# EAGLE design board design (EAGLE 7.6.0)
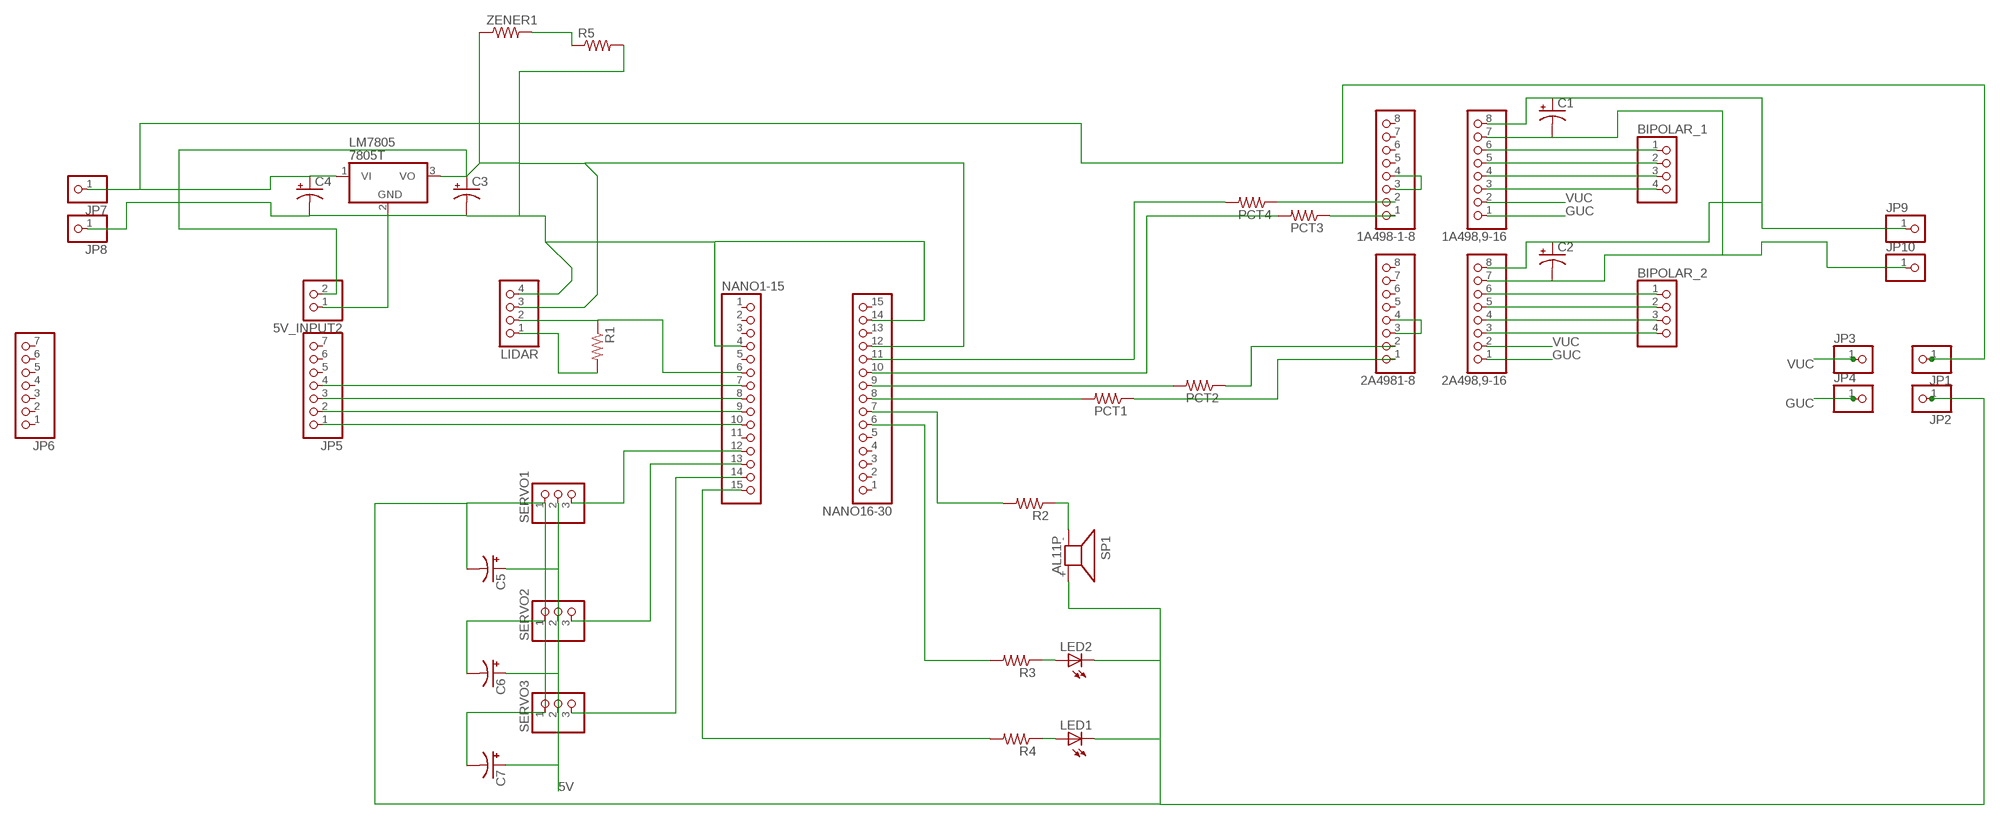
[diagram p0: schematic, sheet 1]

## Parts
1A498,9-16  PINHD-1X8  [1X08]
1A498-1-8  PINHD-1X8  [1X08]
2A498,9-16  PINHD-1X8  [1X08]
2A4981-8  PINHD-1X8  [1X08]
5V_INPUT2  PINHD-1X2  [1X02]
BIPOLAR_1  PINHD-1X4  [1X04]
BIPOLAR_2  PINHD-1X4  [1X04]
C1  CPOL-USE2.5-7  [E2,5-7]
C2  CPOL-USE2.5-7  [E2,5-7]
C3  CPOL-USE2.5-7  [E2,5-7]
C4  CPOL-USE2.5-7  [E2,5-7]
C5  CPOL-USE2.5-7  [E2,5-7]
C6  CPOL-USE2.5-7  [E2,5-7]
C7  CPOL-USE2.5-7  [E2,5-7]
JP1  PINHD-1X1  [1X01]
JP2  PINHD-1X1  [1X01]
JP3  PINHD-1X1  [1X01]
JP4  PINHD-1X1  [1X01]
JP5  PINHD-1X7  [1X07]
JP6  PINHD-1X7  [1X07]
JP7  PINHD-1X1  [1X01]
JP8  PINHD-1X1  [1X01]
JP9  PINHD-1X1  [1X01]
JP10  PINHD-1X1  [1X01]
LED1  LED5MM  [LED5MM]
LED2  LED5MM  [LED5MM]
LIDAR  PINHD-1X4  [1X04]
LM7805  7805T  [TO220H]
NANO1-15  PINHD-1X15  [1X15]
NANO16-30  PINHD-1X15  [1X15]
PCT1  R-US_0207/10  [0207/10]
PCT2  R-US_0207/10  [0207/10]
PCT3  R-US_0207/10  [0207/10]
PCT4  R-US_0207/10  [0207/10]
R1  R-US_0207/10  [0207/10]
R2  R-US_0207/10  [0207/10]
R3  R-US_0207/10  [0207/10]
R4  R-US_0207/10  [0207/10]
R5  R-US_0207/10  [0207/10]
SERVO1  PINHD-1X3  [1X03]
SERVO2  PINHD-1X3  [1X03]
SERVO3  PINHD-1X3  [1X03]
SP1  AL11P  [AL11P]
ZENER1  R-US_0207/10  [0207/10]

## Nets
5V: C4.+ C5.+ C6.+ C7.+ JP1.1 JP7.1 LM7805.1(VI) SERVO1.2 SERVO2.2 SERVO3.2
GUC: 1A498,9-16.1 2A498,9-16.1 JP4.1
N$1: JP5.4 NANO1-15.7
N$2: JP5.3 NANO1-15.8
N$3: JP5.2 NANO1-15.9
N$4: JP5.1 NANO1-15.10
N$5: NANO16-30.7 R2.2
N$6: LED2.A R3.1
N$7: 1A498-1-8.2 PCT4.1
N$8: NANO16-30.8 PCT1.2
N$9: 2A498,9-16.6 BIPOLAR_2.1
N$10: 2A498,9-16.5 BIPOLAR_2.2
N$11: 2A498,9-16.4 BIPOLAR_2.3
N$12: 2A498,9-16.3 BIPOLAR_2.4
N$13: 1A498,9-16.6 BIPOLAR_1.1
N$14: 1A498,9-16.5 BIPOLAR_1.2
N$15: 1A498,9-16.4 BIPOLAR_1.3
N$16: 1A498,9-16.3 BIPOLAR_1.4
N$17: LED1.A R4.1
N$18: NANO1-15.15 R4.2
N$19: R2.1 SP1.-
N$20: LIDAR.2 NANO1-15.6 R1.1
N$21: LIDAR.1 R1.2
N$22: 1A498,9-16.7 2A498,9-16.7 C1.- C2.- JP10.1
N$23: 2A4981-8.3 2A4981-8.4
N$24: 1A498-1-8.3 1A498-1-8.4
N$25: 1A498,9-16.8 2A498,9-16.8 C1.+ C2.+ JP9.1
N$26: NANO1-15.12 SERVO1.3
N$27: NANO1-15.13 SERVO2.3
N$28: NANO1-15.14 SERVO3.3
N$29: NANO16-30.11 PCT4.2
N$30: NANO16-30.10 PCT3.2
N$31: NANO16-30.9 PCT2.2
N$32: 2A4981-8.1 PCT1.1
N$33: NANO16-30.6 R3.2
N$34: 2A4981-8.2 PCT2.1
N$35: 1A498-1-8.1 PCT3.1
N$36: C5.- C6.- C7.- JP2.1 LED1.K(C) LED2.K(C) SERVO1.1 SERVO2.1 SERVO3.1 SP1.+
N$37: 5V_INPUT2.2 C3.+ LIDAR.3 LM7805.3(VO) NANO16-30.12 ZENER1.1
N$38: 5V_INPUT2.1 C3.- C4.- JP8.1 LIDAR.4 LM7805.2(GND) NANO1-15.4 NANO16-30.14 R5.2
N$40: R5.1 ZENER1.2
VUC: 1A498,9-16.2 2A498,9-16.2 JP3.1
Unconnected: 1A498-1-8.5 1A498-1-8.6 1A498-1-8.7 1A498-1-8.8 2A4981-8.5 2A4981-8.6 2A4981-8.7 2A4981-8.8 JP5.5 JP5.6 JP5.7 JP6.1 JP6.2 JP6.3 JP6.4 JP6.5 JP6.6 JP6.7 NANO1-15.1 NANO1-15.2 NANO1-15.3 NANO1-15.5 NANO1-15.11 NANO16-30.1 NANO16-30.2 NANO16-30.3 NANO16-30.4 NANO16-30.5 NANO16-30.13 NANO16-30.15

## Library data of the parts
1A498,9-16 1A498-1-8 2A498,9-16 2A4981-8 = pinhead:PINHD-1X8: PIN HEADER
5V_INPUT2 = pinhead:PINHD-1X2: PIN HEADER
BIPOLAR_1 BIPOLAR_2 LIDAR = pinhead:PINHD-1X4: PIN HEADER
C1-C7 = rcl:CPOL-US: POLARIZED CAPACITOR, American symbol
JP1-JP4 JP7-JP10 = pinhead:PINHD-1X1: PIN HEADER
JP5 JP6 = pinhead:PINHD-1X7: PIN HEADER
LED1 LED2 = led:LED: LED OSRAM: - CHIPLED LG R971, LG N971, LY N971, LG Q971, LY Q971, LO R971, LY R971 LH N974, LH R974 LS Q976, LO Q976, LY Q976 LO Q996 - Hyper CHIPLED LW Q18S LB Q993, LB Q99A, LB R99A - SideLED LS A670, LO A670, LY A670, LG A670, LP A670 LB A673, LV A673, LT A673, LW A673 LH A674 LY A675 LS A676, LA A676, LO A676, LY A676, LW A676 LS A679, LY A679, LG A679 - Hyper Micro SIDELED® LS Y876, LA Y876, LO Y876, LY Y876 LT Y87S - SmartLED LW L88C, LW L88S LB L89C, LB L89S, LG L890 LS L89K, LO L89K, LY L89K LS L896, LA L896, LO L896, LY L896 - TOPLED LS T670, LO T670, LY T670, LG T670, LP T670 LSG T670, LSP T670, LSY T670, LOP T670, LYG T670 LG T671, LOG T671, LSG T671 LB T673, LV T673, LT T673, LW T673 LH T674 LS T676, LA T676, LO T676, LY T676, LB T676, LH T676, LSB T676, LW T676 LB T67C, LV T67C, LT T67C, LS T67K, LO T67K, LY T67K, LW E67C LS E67B, LA E67B, LO E67B, LY E67B, LB E67C, LV E67C, LT E67C LW T67C LS T679, LY T679, LG T679 LS T770, LO T770, LY T770, LG T770, LP T770 LB T773, LV T773, LT T773, LW T773 LH T774 LS E675, LA E675, LY E675, LS T675 LS T776, LA T776, LO T776, LY T776, LB T776 LHGB T686 LT T68C, LB T68C - Hyper Mini TOPLED® LB M676 - Mini TOPLED Santana® LG M470 LS M47K, LO M47K, LY M47K Source: http://www.osram.convergy.de LUXEON: - LUMILED® LXK2-PW12-R00, LXK2-PW12-S00, LXK2-PW14-U00, LXK2-PW14-V00 LXK2-PM12-R00, LXK2-PM12-S00, LXK2-PM14-U00 LXK2-PE12-Q00, LXK2-PE12-R00, LXK2-PE12-S00, LXK2-PE14-T00, LXK2-PE14-U00 LXK2-PB12-K00, LXK2-PB12-L00, LXK2-PB12-M00, LXK2-PB14-N00, LXK2-PB14-P00, LXK2-PB14-Q00 LXK2-PR12-L00, LXK2-PR12-M00, LXK2-PR14-Q00, LXK2-PR14-R00 LXK2-PD12-Q00, LXK2-PD12-R00, LXK2-PD12-S00 LXK2-PH12-R00, LXK2-PH12-S00 LXK2-PL12-P00, LXK2-PL12-Q00, LXK2-PL12-R00 Source: www.luxeon.com KINGBRIGHT: KA-3528ASYC Source: www.kingbright.com
LM7805 = linear:78*: Positive VOLTAGE REGULATOR Source: http://cache.national.com/ds/LM/LM78L05.pdf http://www.fairchildsemi.com/ds/LM/LM7805.pdf
NANO1-15 NANO16-30 = pinhead:PINHD-1X15: PIN HEADER
PCT1-PCT4 R1-R5 ZENER1 = resistor:R-US_: RESISTOR, American symbol
SERVO1-SERVO3 = pinhead:PINHD-1X3: PIN HEADER
SP1 = buzzer:AL11P: SPEAKER Source: Buerklin; OC_FARNELL: unknown; OC_NEWARK: unknown

## Net classes
0 default: width 0.813 mm, drill 0.813 mm, clearance 0.813 mm

## Board
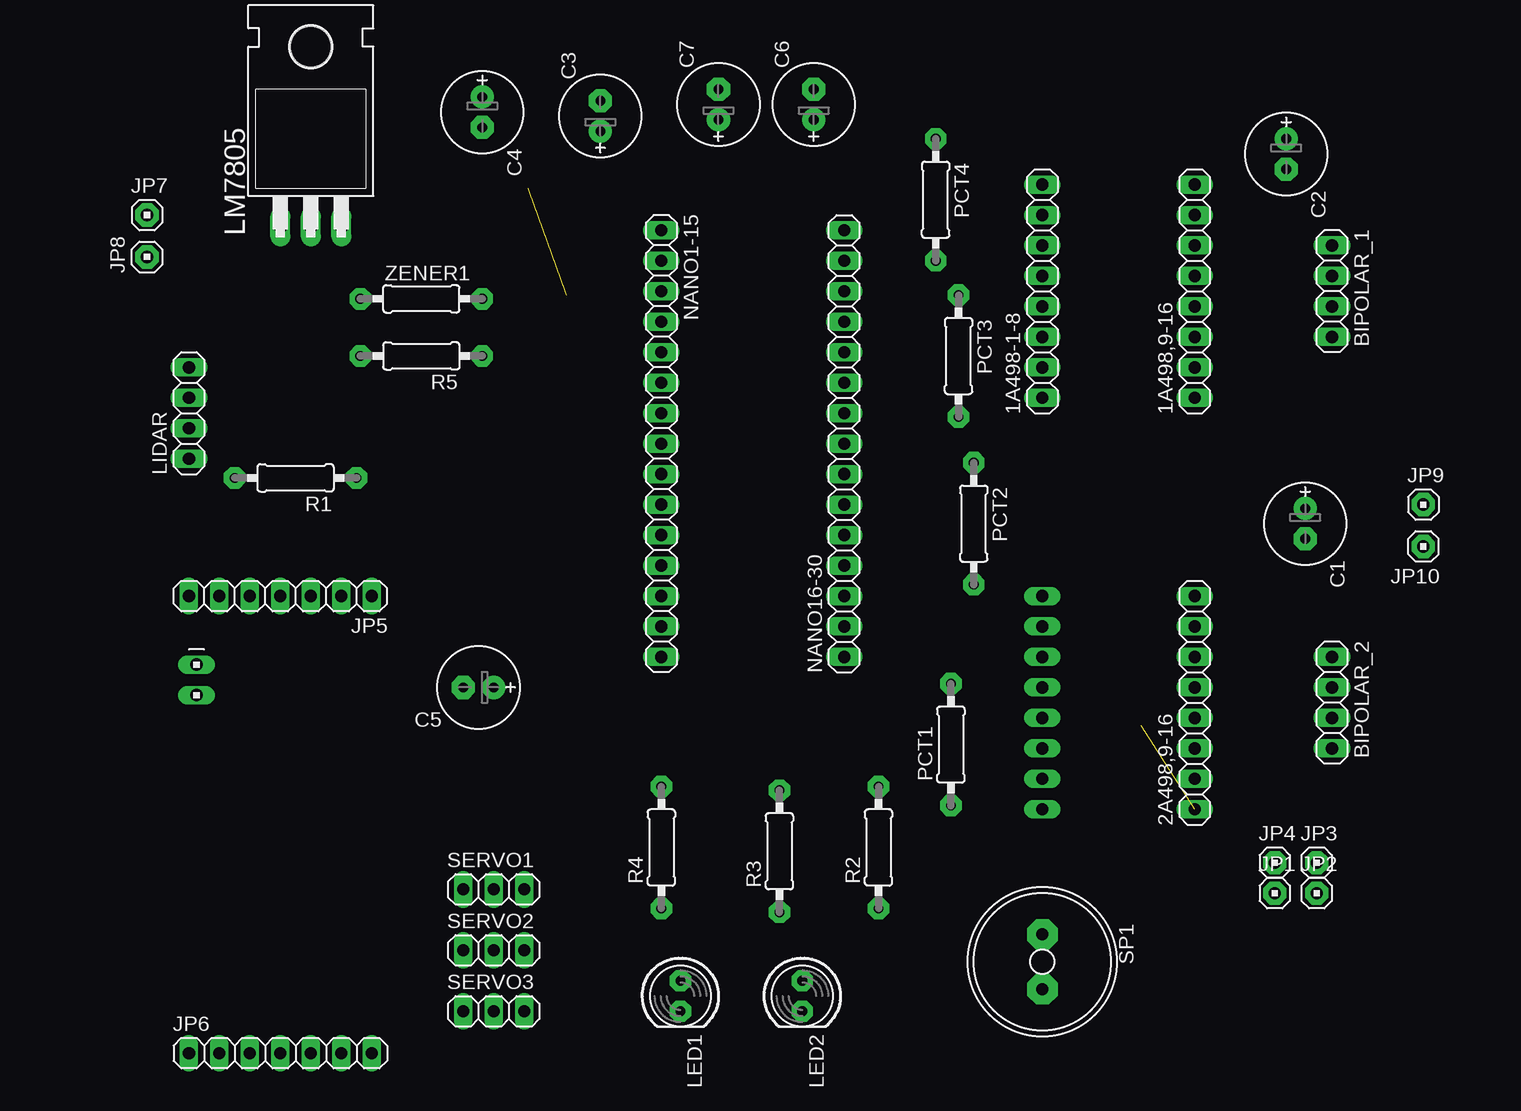
[diagram p1: board, top side]
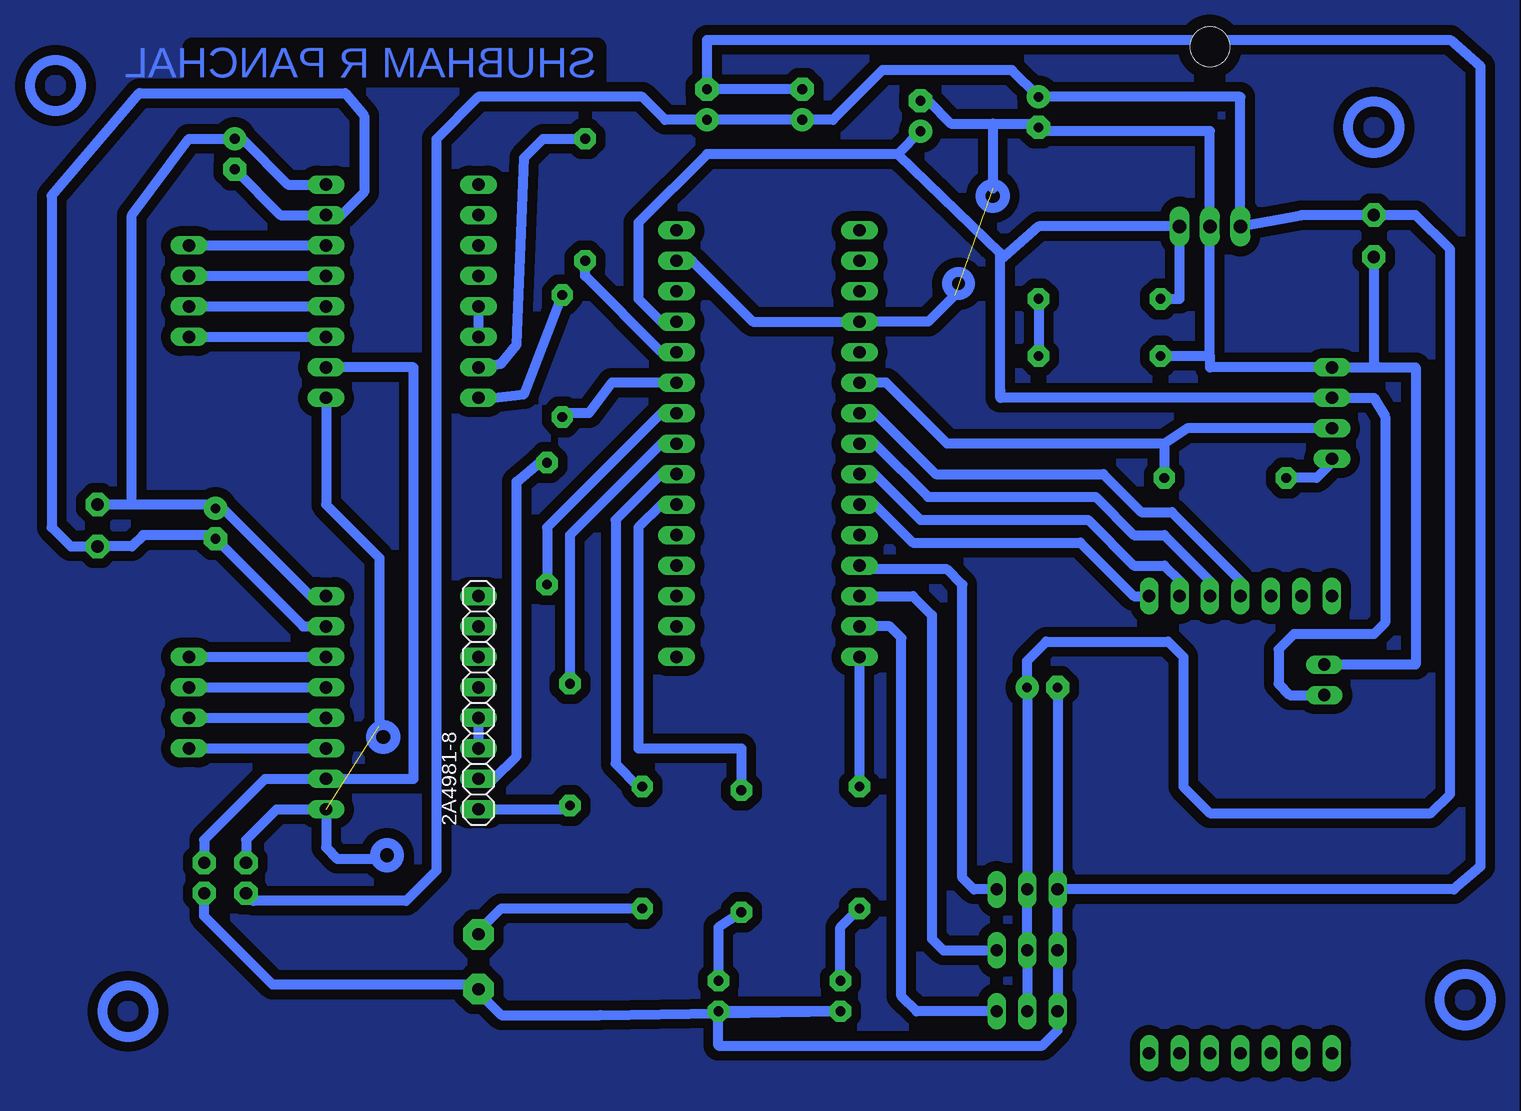
[diagram p2: board, bottom side, seen from below]

No outline drawn. Coordinates in mm, seen from the top.
Copper layers (1*16): Top 0.035mm / dielectric 1.5mm / Bottom 0.035mm
Design rules "default": minimum track width 10mil, minimum drill 24mil, track to track 8mil, track to pad 8mil, pad to pad 8mil, via to via 8mil, smd to smd 8mil, copper to edge 40mil, drill to drill 8mil, minimum pad ring 10mil, minimum via ring 8mil, stop-mask expansion 4mil, vias tented up to drill 0mil, thermal gap 10mil

### Footprints (pad centres in the part's own frame; a part is rotated, then mirrored left to right if it is on the bottom)
1X08 = drill 1.016 long: 1 -8.89,0; 2 -6.35,0; 3 -3.81,0; 4 -1.27,0; 5 1.27,0; 6 3.81,0; 7 6.35,0; 8 8.89,0
1X02 = drill 1.016 long: 1 -1.27,0; 2 1.27,0
1X04 = drill 1.016 long: 1 -3.81,0; 2 -1.27,0; 3 1.27,0; 4 3.81,0
E2,5-7 = drill 0.813 pad 1.93: + -1.27,0 | drill 0.813 pad 1.93 octagon: - 1.27,0
1X01 = drill 1.016 pad 1.93 octagon: 1 0,0
1X07 = drill 1.016 long: 1 -7.62,0; 2 -5.08,0; 3 -2.54,0; 4 0,0; 5 2.54,0; 6 5.08,0; 7 7.62,0
LED5MM = drill 0.813 pad 1.778 octagon: A -1.27,0; K 1.27,0
TO220H = drill 1.118 long: 1 -2.54,-10.16; 2 0,-10.16; 3 2.54,-10.16 | hole 3.302: 0,4.826
1X15 = drill 1.016 long: 1 -17.78,0; 2 -15.24,0; 3 -12.7,0; 4 -10.16,0; 5 -7.62,0; 6 -5.08,0; 7 -2.54,0; 8 0,0; 9 2.54,0; 10 5.08,0; 11 7.62,0; 12 10.16,0; 13 12.7,0; 14 15.24,0; 15 17.78,0
0207/10 = drill 0.813 pad 1.778 octagon: 1 -5.08,0; 2 5.08,0
1X03 = drill 1.016 long: 1 -2.54,0; 2 0,0; 3 2.54,0
AL11P = drill 1.016 pad 2.54 octagon: + 2.286,0; - -2.286,0

### Placement (x,y rotation side)
1A498,9-16  90.81,62.87 90 top
1A498-1-8  78.11,62.87 90 top
2A498,9-16  90.81,28.57 90 top
2A4981-8  78.11,28.57 90 bottom
5V_INPUT2  7.62,30.48 270 top
BIPOLAR_1  102.23,62.87 270 top
BIPOLAR_2  102.23,28.57 270 top
C1  100.01,43.5 270 top
C2  98.42,74.3 270 top
C3  41.27,77.47 90 top
C4  31.43,77.79 270 top
C5  31.11,29.84 180 top
C6  59.05,78.42 90 top
C7  51.12,78.42 90 top
JP1  97.47,12.7 0 top
JP2  100.97,12.7 0 top
JP3  100.97,15.24 0 top
JP4  97.47,15.24 0 top
JP5  14.61,37.47 180 top
JP6  14.61,-0.64 0 top
JP7  3.49,69.22 0 top
JP8  3.49,65.72 90 top
JP9  109.86,45.09 0 top
JP10  109.86,41.59 180 top
LED1  47.94,4.13 270 top
LED2  58.1,4.13 270 top
LIDAR  6.99,52.7 90 top
LM7805  17.14,78.42 0 top
NANO1-15  46.35,50.16 270 top
NANO16-30  61.59,50.16 90 top
PCT1  70.48,25.08 90 top
PCT2  72.39,43.5 270 top
PCT3  71.12,57.47 270 top
PCT4  69.22,70.48 270 top
R1  15.88,47.31 180 top
R2  64.45,16.51 90 top
R3  56.2,16.19 90 top
R4  46.35,16.51 90 top
R5  26.35,57.47 180 top
SERVO1  32.38,13.02 0 top
SERVO2  32.38,7.94 0 top
SERVO3  32.38,2.86 0 top
SP1  78.11,6.99 270 top
ZENER1  26.35,62.23 0 top

### Tracks (layer width: path | path; a pad name or v marks a point on that pad's centre or on a via)
5V
  Bottom 0.813: SERVO3.2 SERVO2.2 SERVO1.2 C5.+ 32.38,32.07 30.8,33.66 20.64,33.66 19.37,32.38 19.37,21.59 17.14,19.37 -1.27,19.37 -2.86,20.95 -2.86,66.36 0,69.22 JP7.1 9.53,69.22 LM7805.1 14.61,79.06 C4.+ 33.66,81.28 44.45,81.28 48.58,77.15 C7.+ C6.+ 62.55,77.15 64.45,79.06 78.11,79.06 81.6,75.56 81.6,14.61 84.14,12.06 96.84,12.06 JP1.1
GUC  (1 unrouted)
  Bottom 0.813: 1A498,9-16.1 90.81,45.09 86.36,40.64 86.36,26.67 | 86.68,15.56 89.85,15.56 90.81,16.51 2A498,9-16.1 94.93,19.68 97.47,17.14 JP4.1
N$1
  Bottom 0.813: JP5.4 14.61,38.73 20.32,44.45 22.86,44.45 26.04,47.62 40.01,47.62 45.09,52.7 NANO1-15.7
N$2
  Bottom 0.813: JP5.3 17.14,38.73 20.95,42.55 23.5,42.55 26.67,45.72 40.64,45.72 45.09,50.16 NANO1-15.8
N$3
  Bottom 0.813: JP5.2 19.68,38.73 20.95,40.01 23.5,40.01 27.3,43.81 41.27,43.81 45.09,47.62 NANO1-15.9
N$4
  Bottom 0.813: JP5.1 23.5,37.47 27.94,41.91 41.91,41.91 45.09,45.09 NANO1-15.10
N$5
  Bottom 0.813: NANO16-30.7 62.87,47.62 66.67,43.81 66.67,23.5 64.77,21.59 R2.2
N$6
  Bottom 0.813: LED2.A 58.1,9.84 R3.1
N$7
  Bottom 0.813: PCT4.1 72.71,75.56 74.3,73.98 74.93,58.42 76.2,56.83 1A498-1-8.2
N$8
  Bottom 0.813: PCT1.2 70.48,42.55 62.87,50.16 NANO16-30.8
N$9
  Bottom 0.813: BIPOLAR_2.1 2A498,9-16.6
N$10
  Bottom 0.813: BIPOLAR_2.2 2A498,9-16.5
N$11
  Bottom 0.813: BIPOLAR_2.3 2A498,9-16.4
N$12
  Bottom 0.813: BIPOLAR_2.4 2A498,9-16.3
N$13
  Bottom 0.813: BIPOLAR_1.1 1A498,9-16.6
N$14
  Bottom 0.813: BIPOLAR_1.2 1A498,9-16.5
N$15
  Bottom 0.813: BIPOLAR_1.3 1A498,9-16.4
N$16
  Bottom 0.813: BIPOLAR_1.4 1A498,9-16.3
N$17
  Bottom 0.813: LED1.A 47.94,9.84 R4.1
N$18
  Bottom 0.813: NANO1-15.15 R4.2
N$19
  Bottom 0.813: R2.1 76.2,11.43 78.11,9.53 SP1.-
N$20
  Bottom 0.813: 20.95,50.16 19.05,51.44 LIDAR.2 | 20.95,50.16 R1.1 | 20.95,50.16 39.05,50.16 44.13,55.24 NANO1-15.6
N$21
  Bottom 0.813: LIDAR.1 6.99,48.58 8.26,47.31 R1.2
N$22
  Bottom 0.813: C2.- 94.61,69.22 1A498,9-16.7 89.53,69.22 87.63,71.12 87.63,77.47 89.22,79.38 106.36,79.38 113.67,70.8 113.67,43.18 112.08,41.59 JP10.1 107,41.59 106.05,42.55 100.33,42.55 C1.- 92.71,34.92 2A498,9-16.7
N$23
  Bottom 0.813: 2A4981-8.4 2A4981-8.3
N$24
  Bottom 0.813: 1A498-1-8.4 1A498-1-8.3
N$25
  Bottom 0.813: 1A498,9-16.8 93.98,71.75 97.79,75.56 C2.+ 102.23,75.56 107,69.22 107,45.09 | 2A498,9-16.8 92.08,37.47 99.69,45.09 C1.+ 100.33,45.09 107,45.09 | 107,45.09 JP9.1
N$26
  Bottom 0.813: SERVO1.3 36.83,13.02 37.78,13.97 37.78,38.42 39.05,39.69 46.04,39.69 NANO1-15.12
N$27
  Bottom 0.813: NANO1-15.13 41.91,37.47 40.32,35.88 40.32,8.89 39.37,7.94 SERVO2.3
N$28
  Bottom 0.813: SERVO3.3 41.59,2.86 42.86,4.13 42.86,33.97 43.81,34.92 NANO1-15.14
N$29
  Bottom 0.813: PCT4.2 69.22,64.14 62.87,57.78 NANO16-30.11
N$30
  Bottom 0.813: NANO16-30.10 66.99,55.24 68.9,52.7 71.12,52.7 PCT3.2
N$31
  Bottom 0.813: PCT2.2 72.39,43.18 62.87,52.7 NANO16-30.9
N$32
  Bottom 0.813: 2A4981-8.1 70.48,19.68 PCT1.1
N$33
  Bottom 0.813: R3.2 56.2,24.77 64.77,24.77 64.77,43.18 62.87,45.09 NANO16-30.6
N$34
  Bottom 0.813: 2A4981-8.2 76.83,22.23 74.93,24.13 74.93,46.99 73.03,48.58 PCT2.1
N$35
  Bottom 0.813: PCT3.1 74.3,54.29 76.83,53.98 1A498-1-8.1
N$36
  Bottom 0.813: SERVO1.1 SERVO2.1 SERVO3.1 29.84,1.27 31.11,0 58.1,0 LED2.K LED1.K 67.94,2.54 76.2,2.54 78.11,4.45 SP1.+ 78.11,5.08 95.25,5.08 100.97,10.79 JP2.1 | SERVO1.1 -3.17,13.02 -5.4,14.92 -5.4,81.6 -2.86,83.82 59.05,83.82 C6.- C7.- | C5.- SERVO1.1
N$37
  Bottom 0.813: NANO16-30.12 62.87,60.33 64.77,62.23 64.77,68.58 59.05,74.3 43.18,74.3 | C3.+ 43.18,74.3 | 43.18,74.3 34.61,66.03 | 34.61,66.03 34.29,65.72 31.43,68.26 LM7805.3 19.68,67.63 | 5V_INPUT2.2 10.48,29.21 11.43,30.16 11.43,33.02 10.16,34.29 3.49,34.29 2.54,35.24 2.54,52.39 3.49,53.98 LIDAR.3 34.61,53.98 34.61,54.61 34.61,66.03 | ZENER1.1 19.68,62.23 19.68,67.63 | 20,67.63 19.68,67.63
N$38  (1 unrouted)
  Bottom 0.813: NANO16-30.14 60.33,65.41 55.24,60.33 NANO1-15.4 40.64,60.33 38.42,62.55 | 35.24,76.83 31.75,76.83 C4.- 31.11,76.2 17.14,76.2 LM7805.2 17.14,57.47 | C3.- 40.64,78.74 38.73,76.83 35.24,76.83 | 5V_INPUT2.1 0,31.75 0,56.52 3.17,56.52 | 3.17,56.52 LIDAR.4 17.14,56.52 17.14,57.47 | 35.24,76.83 35.24,71.44 | JP8.1 3.49,56.83 3.17,56.52 | R5.2 17.14,57.47
N$39
  pour Bottom: -8.26,87.95 117.79,87.95 117.79,-6.03 -8.26,-6.03
N$40
  Bottom 0.813: ZENER1.2 R5.1
VUC
  Bottom 0.813: 1A498,9-16.2 83.5,56.52 83.5,22.23 2A498,9-16.2 95.89,22.23 100.97,17.14 JP3.1
(copper drawn outside any net)
  shapes: Bottom circle x8

### Text on the board
Bottom: SHUBHAM R PANCHAL